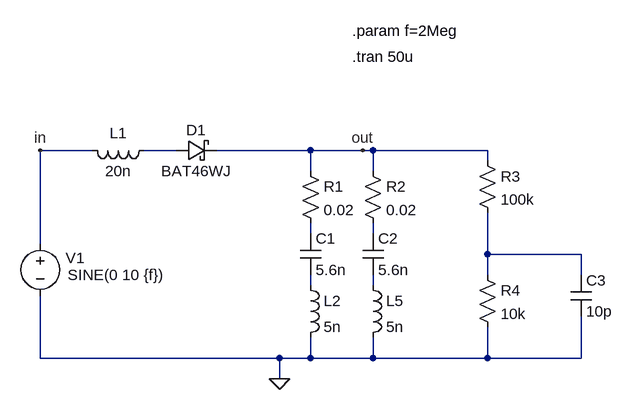
[diagram p0: schematic peak_detector_ideal.asc]
peak_detector_ideal.asc, the LTspice schematic file:
Version 4
SHEET 1 1120 680
WIRE -32 48 -112 48
WIRE 96 48 48 48
WIRE 304 48 160 48
WIRE 384 48 304 48
WIRE 400 48 384 48
WIRE 576 48 400 48
WIRE 576 64 576 48
WIRE 304 80 304 48
WIRE 400 80 400 48
WIRE 304 176 304 160
WIRE 400 176 400 160
WIRE -112 192 -112 48
WIRE 576 208 576 144
WIRE 720 208 576 208
WIRE 576 240 576 208
WIRE 720 240 720 208
WIRE 304 256 304 240
WIRE 400 256 400 240
WIRE -112 368 -112 272
WIRE 256 368 -112 368
WIRE 304 368 304 336
WIRE 304 368 256 368
WIRE 400 368 400 336
WIRE 400 368 304 368
WIRE 576 368 576 320
WIRE 576 368 400 368
WIRE 720 368 720 304
WIRE 720 368 576 368
WIRE 256 400 256 368
FLAG 384 48 out
FLAG -112 48 in
FLAG 256 400 0
SYMBOL cap 288 176 R0
SYMATTR InstName C1
SYMATTR Value 5.6n
SYMBOL schottky 96 64 R270
WINDOW 0 32 32 VTop 2
WINDOW 3 0 32 VBottom 2
SYMATTR InstName D1
SYMATTR Value BAT46WJ
SYMATTR Description Diode
SYMATTR Type diode
SYMBOL voltage -112 176 R0
WINDOW 3 42 64 Left 2
WINDOW 123 24 124 Left 2
WINDOW 39 0 0 Left 0
WINDOW 0 39 38 Left 2
SYMATTR Value SINE(0 10 {f})
SYMATTR InstName V1
SYMBOL ind 64 32 R90
WINDOW 0 5 56 VBottom 2
WINDOW 3 32 56 VTop 2
SYMATTR InstName L1
SYMATTR Value 20n
SYMBOL ind 288 240 R0
SYMATTR InstName L2
SYMATTR Value 5n
SYMBOL cap 384 176 R0
SYMATTR InstName C2
SYMATTR Value 5.6n
SYMBOL ind 384 240 R0
SYMATTR InstName L5
SYMATTR Value 5n
SYMBOL res 288 64 R0
SYMATTR InstName R1
SYMATTR Value 0.02
SYMBOL res 384 64 R0
SYMATTR InstName R2
SYMATTR Value 0.02
SYMBOL res 560 48 R0
SYMATTR InstName R3
SYMATTR Value 100k
SYMBOL res 560 224 R0
SYMATTR InstName R4
SYMATTR Value 10k
SYMBOL cap 704 240 R0
SYMATTR InstName C3
SYMATTR Value 10p
TEXT 368 -136 Left 2 !.param f=2Meg
TEXT 368 -96 Left 2 !.tran 50u

The netlist it stands for:
* peak_detector_ideal.asc
C1 N002 N005 5.6n
D1 N001 out BAT46WJ
V1 in 0 SINE(0 10 {f})
L1 N001 in 20n
L2 N005 0 5n
C2 N003 N006 5.6n
L5 N006 0 5n
R1 out N002 0.02
R2 out N003 0.02
R3 out N004 100k
R4 N004 0 10k
C3 N004 0 10p
.model D D
.lib standard.dio
.param f=2Meg
.tran 50u
.backanno
.end